# EasyEDA Pro project LED伏安特性实验仪.eprj, schematic 供电加恒流源

## Sheets
1 24V恒流源: Create Date: 2025-05-09; Page Name: 24V恒流源; Project Name: LED伏安特性实验仪; Schematic Name: 供电加恒流源; Update Date: 2026-06-09; Company: 嘉立创EDA; Page Size: A4; Version: V1.0
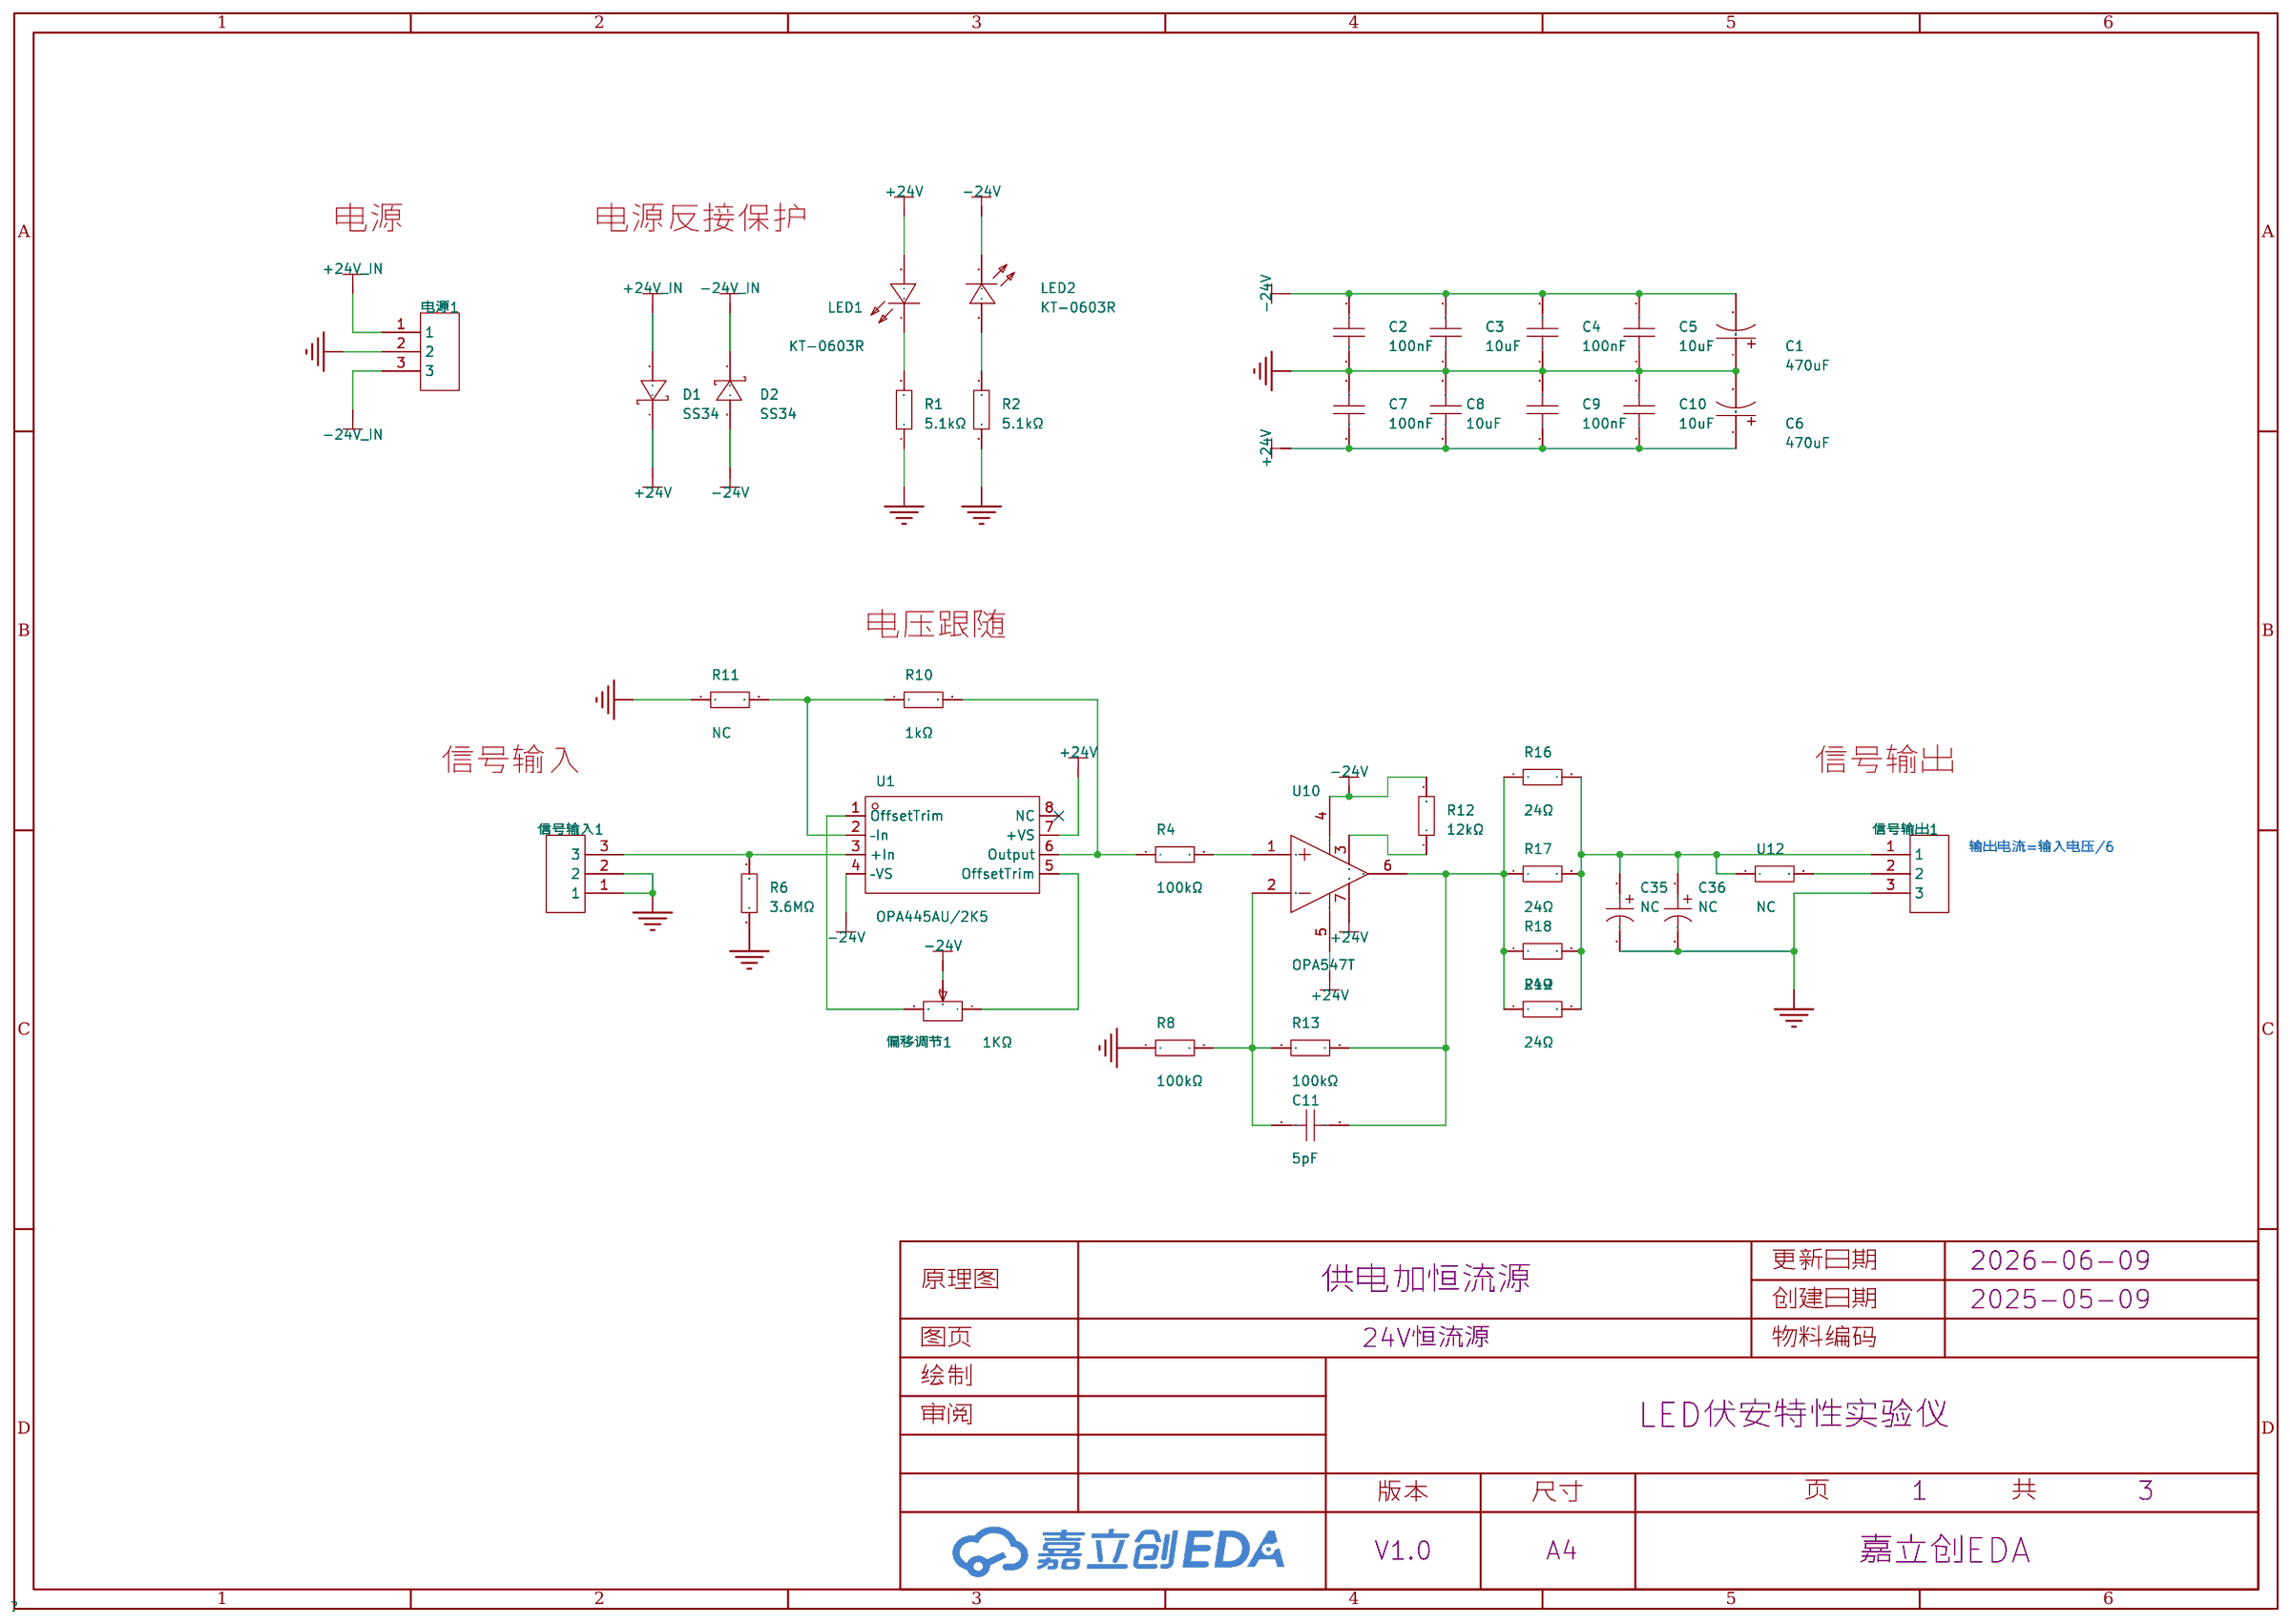
[diagram p4: 24V恒流源]
2 12V恒流源: Page Name: 12V恒流源; Project Name: 光磁共振实验仪; Update Date: 2025-05-09
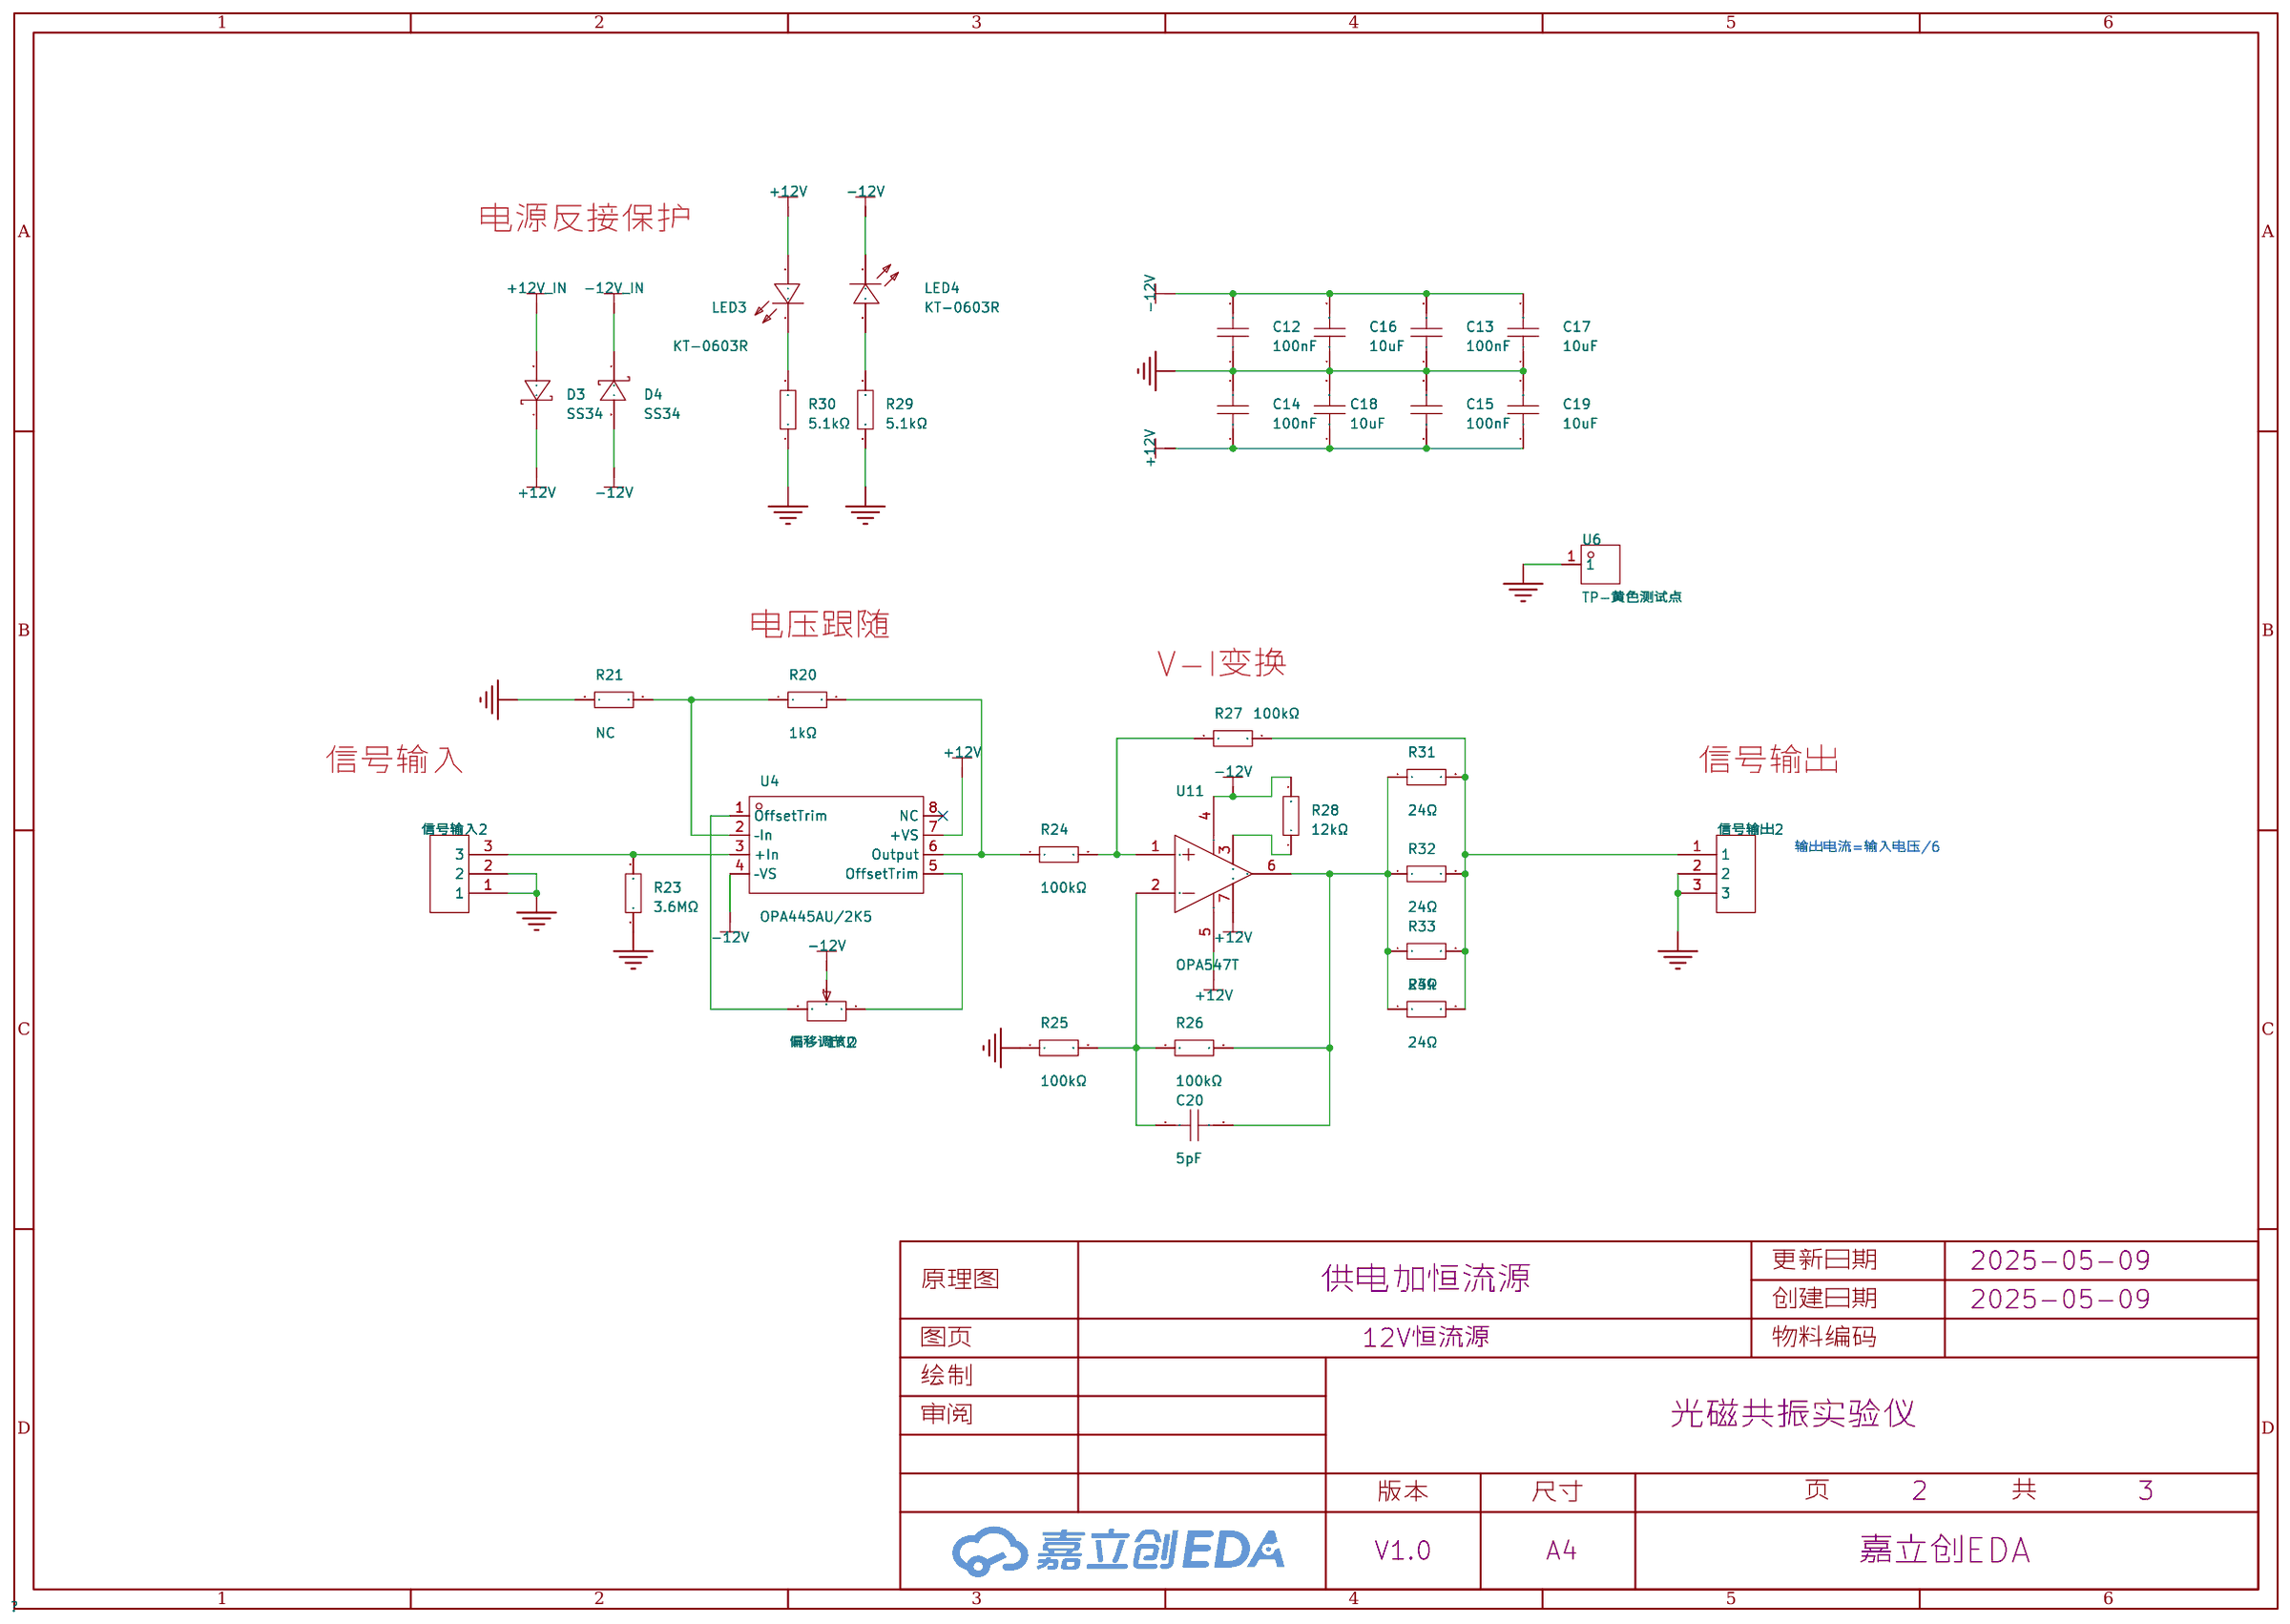
[diagram p5: 12V恒流源]
3 电源: Page Name: 电源; Project Name: 光磁共振实验仪; Update Date: 2025-05-09
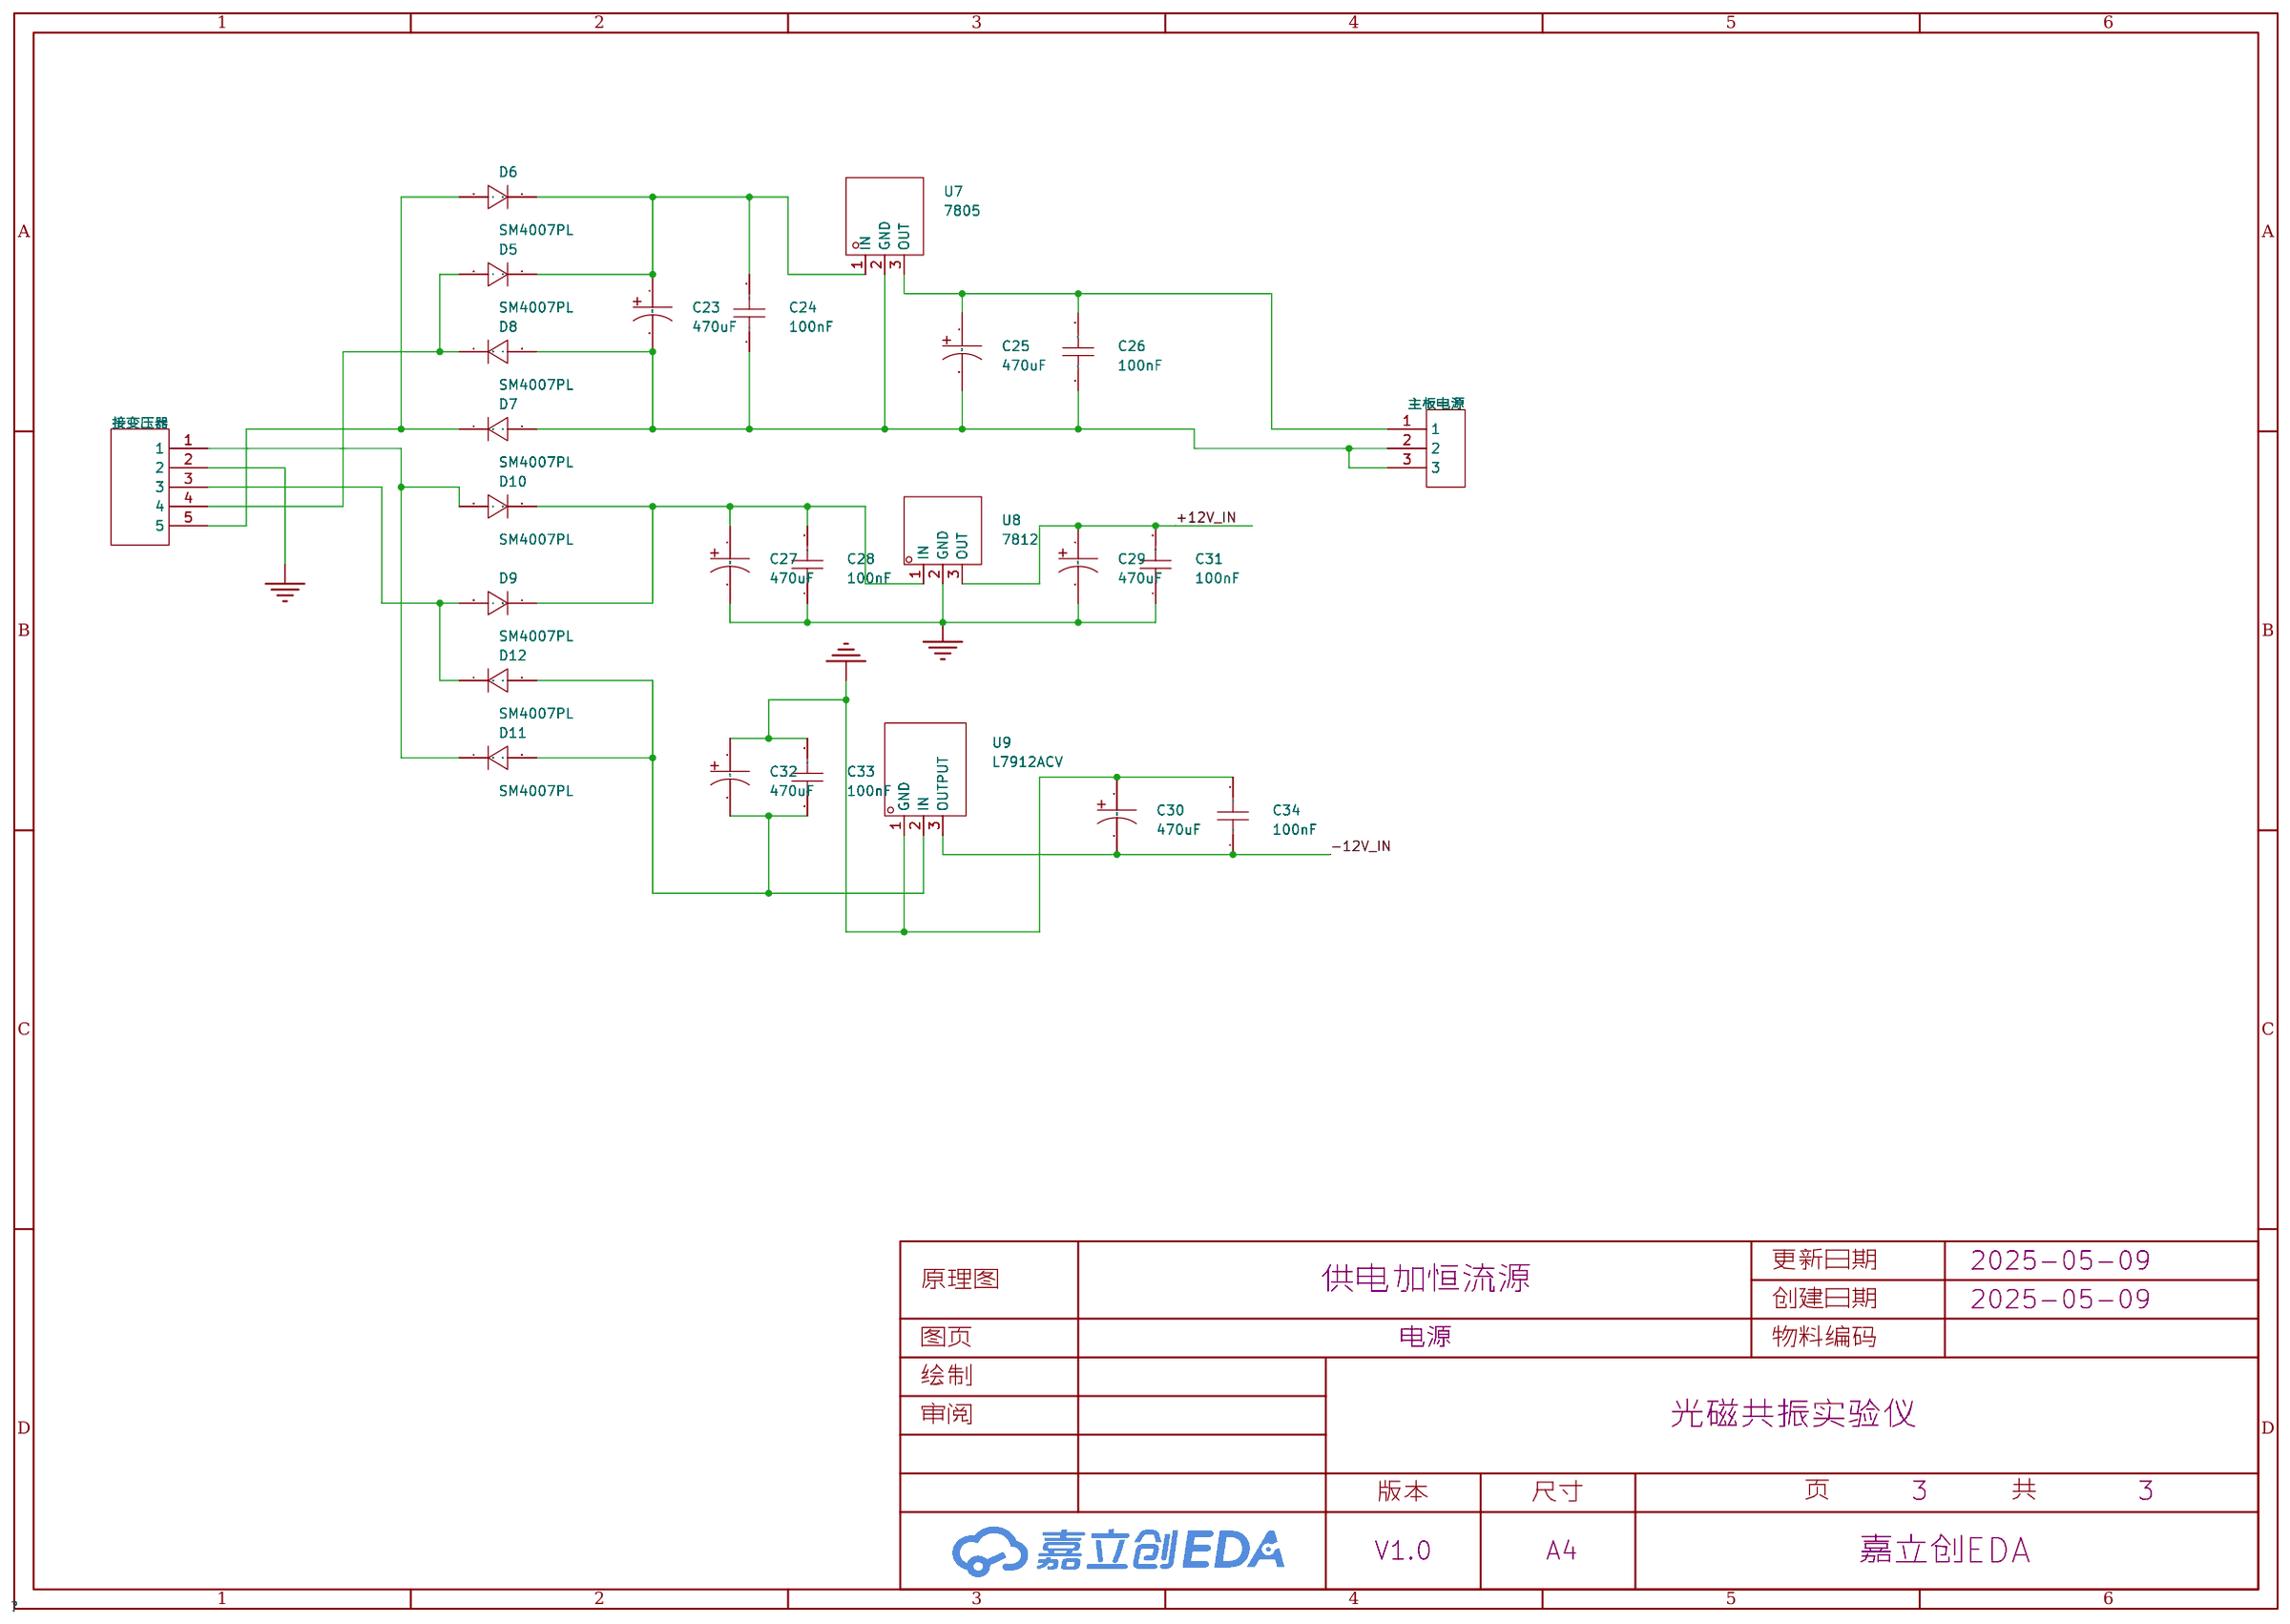
[diagram p6: 电源]

## Parts
sheet 12V恒流源
C12  100nF  [C0603]
C13  100nF  [C0603]
C14  100nF  [C0603]
C15  100nF  [C0603]
C16  10uF  [C0603]
C17  10uF  [C0603]
C18  10uF  [C0603]
C19  10uF  [C0603]
C20  5pF  [C0603]
D3  SS34  [SMA_L4.3-W2.6-LS5.2-RD]
D4  SS34  [SMA_L4.3-W2.6-LS5.2-RD]
LED3  KT-0603R  [LED0603-RD]
LED4  KT-0603R  [LED0603-RD]
R20  1kΩ  [R0603]
R21  NC  [R0603]
R23  3.6MΩ  [R0603]
R24  100kΩ  [R0603]
R25  100kΩ  [R0603]
R26  100kΩ  [R0603]
R27  100kΩ  [R0603]
R28  12kΩ  [R0603]
R29  5.1kΩ  [R0603]
R30  5.1kΩ  [R0603]
R31  24Ω  [R2512]
R32  24Ω  [R2512]
R33  24Ω  [R2512]
R34  24Ω  [R2512]
U4  OPA445AU/2K5  [SOIC-8_L4.9-W3.9-P1.27-LS6.0-BL]
U6  TP-黄色测试点  [TESTPOINT-TH_BD3.2]
U11  OPA547T  [TO-220-7-L10.5-W4.5-P1.27-BL]
信号输入2  -  [CH2.54-3插座]
信号输出2  -  [CH2.54-3插座]
偏移调节2  1KΩ  [RES-ADJ-TH_3296W]
sheet 24V恒流源
C1  470uF  [cap-th_bd8.0-p3.50-d0.6-fd_1]
C2  100nF  [C0603]
C3  10uF  [C0603]
C4  100nF  [C0603]
C5  10uF  [C0603]
C6  470uF  [cap-th_bd8.0-p3.50-d0.6-fd_1]
C7  100nF  [C0603]
C8  10uF  [C0603]
C9  100nF  [C0603]
C10  10uF  [C0603]
C11  5pF  [C0603]
C35  NC  [CAP-TH_BD8.0-P3.50-D0.6-FD_1]
C36  NC  [CAP-TH_BD8.0-P3.50-D0.6-FD_1]
D1  SS34  [SMA_L4.3-W2.6-LS5.2-RD]
D2  SS34  [SMA_L4.3-W2.6-LS5.2-RD]
LED1  KT-0603R  [LED0603-RD]
LED2  KT-0603R  [LED0603-RD]
R1  5.1kΩ  [R0603]
R2  5.1kΩ  [R0603]
R4  100kΩ  [R0603]
R6  3.6MΩ  [R0603]
R8  100kΩ  [R0603]
R10  1kΩ  [R0603]
R11  NC  [R0603]
R12  12kΩ  [R0603]
R13  100kΩ  [R0603]
R16  24Ω  [R2512]
R17  24Ω  [R2512]
R18  24Ω  [R2512]
R19  24Ω  [R2512]
U1  OPA445AU/2K5  [SOIC-8_L4.9-W3.9-P1.27-LS6.0-BL]
U10  OPA547T  [TO-220-7-L10.5-W4.5-P1.27-BL]
U12  NC  [绕线电阻2W]
信号输入1  -  [CH2.54-3插座]
信号输出1  -  [CH2.54-3插座]
偏移调节1  1KΩ  [RES-ADJ-TH_3296W]
电源1  -  [CH2.54-3插座]
sheet 电源
C23  470uF  [cap-th_bd8.0-p3.50-d0.6-fd_1]
C24  100nF  [C0603]
C25  470uF  [cap-th_bd8.0-p3.50-d0.6-fd_1]
C26  100nF  [C0603]
C27  470uF  [cap-th_bd8.0-p3.50-d0.6-fd_1]
C28  100nF  [C0603]
C29  470uF  [cap-th_bd8.0-p3.50-d0.6-fd_1]
C30  470uF  [cap-th_bd8.0-p3.50-d0.6-fd_1]
C31  100nF  [C0603]
C32  470uF  [cap-th_bd8.0-p3.50-d0.6-fd_1]
C33  100nF  [C0603]
C34  100nF  [C0603]
D5  SM4007PL  [SOD-123F_L2.8-W1.8-LS3.7-RD]
D6  SM4007PL  [SOD-123F_L2.8-W1.8-LS3.7-RD]
D7  SM4007PL  [SOD-123F_L2.8-W1.8-LS3.7-RD]
D8  SM4007PL  [SOD-123F_L2.8-W1.8-LS3.7-RD]
D9  SM4007PL  [SOD-123F_L2.8-W1.8-LS3.7-RD]
D10  SM4007PL  [SOD-123F_L2.8-W1.8-LS3.7-RD]
D11  SM4007PL  [SOD-123F_L2.8-W1.8-LS3.7-RD]
D12  SM4007PL  [SOD-123F_L2.8-W1.8-LS3.7-RD]
U7  7805  [TO-220-3_L10.2-W4.5-P2.54-L-1]
U8  7812  [TO-220-3_L10.0-W4.5-P2.54-L]
U9  L7912ACV  [TO-220-3_L10.0-W4.5-P2.54-T]
主板电源  -  [CH2.54-3插座]
接变压器  -  [CH2.54-5插座]

## Library data of the parts
C2 C4 C7 C9 C12-C15 C24 C26 C28 C31 C33 C34 = CC0603KRX7R9BB104: 容值:100nF;精度:±10%;额定电压:50V;材质(温度系数):X7R;; LCSC Part Name: 100nF ±10% 50V; Supplier Part: C14663; Manufacturer: YAGEO(国巨); Supplier Footprint: 0603; JLCPCB Part Class: 基础库; Datasheet: https://atta.szlcsc.com/upload/public/pdf/source/20180910/C282072_33301C7F631E79921B82A8DAC6BCC5B3.pdf; Supplier: LCSC; Tolerance: ±10%; Voltage Rated: 50V; Temperature Coefficient: X7R
C3 C5 C8 C10 C16-C19 = CL10A106MA8NRNC: 容值:10uF;精度:±20%;额定电压:25V;材质(温度系数):X5R;; LCSC Part Name: 10uF ±20% 25V; Supplier Part: C96446; Manufacturer: SAMSUNG(三星); Supplier Footprint: 0603; JLCPCB Part Class: 基础库; Datasheet: https://atta.szlcsc.com/upload/public/pdf/source/20160218/1457707763339.pdf; Supplier: LCSC; Tolerance: ±20%; Voltage Rated: 25V; Temperature Coefficient: X5R
C11 C20 = CGA3E2C0G2A050C080AA: 容值:5pF;额定电压:100V;材质(温度系数):C0G;; LCSC Part Name: 5pF 100V ±0.25pF; Supplier Part: C3879212; Manufacturer: TDK; Supplier Footprint: 0603; JLCPCB Part Class: 扩展库; Datasheet: https://atta.szlcsc.com/upload/public/pdf/source/20230606/D94174B26D5D12F87246C65F1689D091.pdf; Supplier: LCSC; Voltage Rated: 100V; Temperature Coefficient: C0G
D1-D4 = SS34_C8678: 二极管配置:独立式;正向压降(Vf):550mV@3A;直流反向耐压(Vr):40V;整流电流:3A;; LCSC Part Name: 电压:40V 电流:3A; Supplier Part: C8678; Manufacturer: MDD(辰达半导体); Supplier Footprint: SMA(DO-214AC); JLCPCB Part Class: 基础库; Datasheet: https://atta.szlcsc.com/upload/public/pdf/source/20240710/2118BB86FDDB2E0B294389AC1F3F65C8.pdf; Supplier: LCSC; Diode Configuration: 独立式; Forward Voltage (Vf@If): 550mV@3A; Reverse Voltage (Vr): 40V; Rectified Current: 3A; Reverse Leakage Current (Ir): 500uA@40V
LED1-LED4 = KT-0603R: 发光颜色:红色;功率:-;正向电流:-;主波长:-;二极管配置:-;透镜颜色:-;色温:-;发光角度:-;载带方式:-;工作温度:-40℃~+85℃;; LCSC Part Name: 0603 红灯 高亮; Supplier Part: C2286; Manufacturer: KENTO; Supplier Footprint: 0603; JLCPCB Part Class: 基础库; Datasheet: https://atta.szlcsc.com/upload/public/pdf/source/20160616/1466072038404.pdf; Supplier: LCSC; Emitted Color: 红色; Operating Temperature: -40℃~+85℃
R10 R11 R20 R21 = 0603WAF1001T5E: 电阻类型:厚膜电阻;阻值:1kΩ;精度:±1%;功率:100mW;最大工作电压:75V;温度系数:±100ppm/℃;; LCSC Part Name: 1kΩ ±1% 100mW 厚膜电阻; Supplier Part: C21190; Manufacturer: UNI-ROYAL(厚声); Supplier Footprint: 0603; JLCPCB Part Class: 基础库; Datasheet: https://atta.szlcsc.com/upload/public/pdf/source/20200306/C422600_1E6D84923E4A46A82E41ADD87F860B5C.pdf; Supplier: LCSC; Type: 厚膜电阻; Tolerance: ±1%; Power(Watts): 100mW; Overload Voltage (Max): 75V; Temperature Coefficient: ±100ppm/℃; Operating Temperature Range: -55℃~+155℃
R6 R23 = RTT03365JTP: 电阻类型:厚膜电阻;阻值:3.6MΩ;精度:±5%;功率:100mW;最大工作电压:75V;温度系数:±100ppm/℃;; LCSC Part Name: 厚膜电阻 3.6MΩ ±5% 100mW; Supplier Part: C103584; Manufacturer: RALEC(旺诠); Supplier Footprint: 0603; JLCPCB Part Class: 扩展库; Datasheet: https://atta.szlcsc.com/upload/public/pdf/source/20191219/C158410_884373A5B7E1BC76BF57BC45A946C093.pdf; Supplier: LCSC; Type: 厚膜电阻; Tolerance: ±5%; Power(Watts): 100mW; Overload Voltage (Max): 75V; Temperature Coefficient: ±100ppm/℃; Operating Temperature Range: -55℃~+155℃
R4 R8 R13 R24-R27 = 0603WAF1003T5E: 电阻类型:厚膜电阻;阻值:100kΩ;精度:±1%;功率:100mW;最大工作电压:75V;温度系数:±100ppm/℃;; LCSC Part Name: 100kΩ ±1% 100mW 厚膜电阻; Supplier Part: C25803; Manufacturer: UNI-ROYAL(厚声); Supplier Footprint: 0603; JLCPCB Part Class: 基础库; Datasheet: https://atta.szlcsc.com/upload/public/pdf/source/20200306/C422600_1E6D84923E4A46A82E41ADD87F860B5C.pdf; Supplier: LCSC; Type: 厚膜电阻; Tolerance: ±1%; Power(Watts): 100mW; Overload Voltage (Max): 75V; Temperature Coefficient: ±100ppm/℃; Operating Temperature Range: -55℃~+155℃
R12 R28 = 0603WAF1202T5E: 电阻类型:厚膜电阻;阻值:12kΩ;精度:±1%;功率:100mW;最大工作电压:75V;温度系数:±100ppm/℃;; LCSC Part Name: 12kΩ ±1% 100mW 厚膜电阻; Supplier Part: C22790; Manufacturer: UNI-ROYAL(厚声); Supplier Footprint: 0603; JLCPCB Part Class: 基础库; Datasheet: https://atta.szlcsc.com/upload/public/pdf/source/20200306/C422600_1E6D84923E4A46A82E41ADD87F860B5C.pdf; Supplier: LCSC; Type: 厚膜电阻; Tolerance: ±1%; Power(Watts): 100mW; Overload Voltage (Max): 75V; Temperature Coefficient: ±100ppm/℃; Operating Temperature Range: -55℃~+155℃
R1 R2 R29 R30 = 0603WAF5101T5E: 电阻类型:厚膜电阻;阻值:5.1kΩ;精度:±1%;功率:100mW;最大工作电压:75V;温度系数:±100ppm/℃;; LCSC Part Name: 5.1kΩ ±1% 100mW 厚膜电阻; Supplier Part: C23186; Manufacturer: UNI-ROYAL(厚声); Supplier Footprint: 0603; JLCPCB Part Class: 基础库; Datasheet: https://atta.szlcsc.com/upload/public/pdf/source/20200306/C422600_1E6D84923E4A46A82E41ADD87F860B5C.pdf; Supplier: LCSC; Type: 厚膜电阻; Tolerance: ±1%; Power(Watts): 100mW; Overload Voltage (Max): 75V; Temperature Coefficient: ±100ppm/℃; Operating Temperature Range: -55℃~+155℃
R16-R19 R31-R34 = CRH2512F24R0E04Z: 电阻类型:厚膜电阻;阻值:24Ω;精度:±1%;功率:2W;最大工作电压:200V;温度系数:±100ppm/℃;; LCSC Part Name: 厚膜电阻 24Ω ±1% 2W; Supplier Part: C175254; Manufacturer: EVER OHMS(天二科技); Supplier Footprint: 2512; JLCPCB Part Class: 扩展库; Datasheet: https://atta.szlcsc.com/upload/public/pdf/source/20190415/C175809_DD1C9F6158BC05995187FFAA24C3E24C.pdf; Supplier: LCSC; Type: 厚膜电阻; Tolerance: ±1%; Power(Watts): 2W; Overload Voltage (Max): 200V; Temperature Coefficient: ±100ppm/℃; Operating Temperature Range: -55℃~+155℃
U1 U4 = OPA445AU/2K5: OPA445 高电压 FET 输入运算放大器; Supplier Part: C1348606; Manufacturer: TI(德州仪器); Supplier Footprint: SOIC-8; JLCPCB Part Class: 扩展库; Datasheet: https://www.ti.com/cn/lit/gpn/opa445; Supplier: LCSC
U6 = TP-黄色测试点: Supplier Part: C9900007422; Supplier Footprint: TESTPOINT-TH_BD-2P-P2.00; JLCPCB Part Class: 扩展库; Supplier: LCSC
U10 U11 = OPA547T: 放大器数:单路;增益带宽积(GBP):1MHz;压摆率(SR):6V/us;输入偏置电流(Ib):100nA;; Supplier Part: C138711; Manufacturer: TI(德州仪器); Supplier Footprint: TO-220-7; JLCPCB Part Class: 扩展库; Datasheet: https://www.ti.com/cn/lit/gpn/opa547; Supplier: LCSC; Number of Channels: 单路; Gain Bandwidth Product: 1MHz; Slew Rate: 6V/us; Ib - Input Bias Current: 100nA; Quiescent Current: 10mA; Output Current: 750mA; Operating Temperature: -40℃~+85℃
主板电源 信号输入1 信号输入2 信号输出1 信号输出2 电源1 = HDR-3P
偏移调节1 偏移调节2 = 环保 3296W-1-202LF: 阻值:-;功率:-;; LCSC Part Name: 2KΩ ±10% ±250ppm/℃; Supplier Part: C5028; Supplier Footprint: 3296W; JLCPCB Part Class: 扩展库; Supplier: LCSC
C1 C6 C23 C25 C27 C29 C30 C32 = RVT1A471M0607_C335982: 容值:470uF;精度:±20%;额定电压:10V;纹波电流:200mA@120Hz;等效串联电阻:-;; LCSC Part Name: 470uF ±20% 10V; Supplier Part: C335982; Manufacturer: ROQANG(容强); Manufacturer Part: RVT1A471M0607; Supplier Footprint: SMD,D6.3xL7.7mm; Datasheet: https://atta.szlcsc.com/upload/public/pdf/source/20181128/C335987_23CA7AA50FB42690DF736C43FE112376.pdf; Supplier: LCSC; Tolerance: ±20%; Rated Voltage: 10V; Ripple Current: 200mA@120Hz; φD: 6.3mm; L: 7.7mm; Lifetime @ Temp: 2000hrs@105℃; Operating Temperature: -40℃~+105℃
C35 C36 = 100uF: Supplier Part: C9900016884; Supplier Footprint: CAP-TH_BD8.0-P3.50-D1.0-FD; JLCPCB Part Class: 扩展库; Supplier: LCSC
U12 = 功率电阻5W
D5-D12 = SM4007PL_C64898: 二极管配置:独立式;正向压降(Vf):1.1V@1A;直流反向耐压(Vr):1kV;整流电流:1A;; LCSC Part Name: 电压:1kV 电流:1A; Supplier Part: C64898; Manufacturer: MDD(辰达半导体); Supplier Footprint: SOD-123FL; JLCPCB Part Class: 基础库; Datasheet: https://atta.szlcsc.com/upload/public/pdf/source/20230823/16A8FDE162764C9B685A3717F2DA3690.pdf; Supplier: LCSC; Diode Configuration: 独立式; Forward Voltage (Vf@If): 1.1V@1A; Reverse Voltage (Vr): 1kV; Rectified Current: 1A; Reverse Leakage Current: 10uA@1kV
U7 = 7805: 输出类型:固定;最大输入电压:35V;输出电压:5V;最大输出电流:1.5A;电源纹波抑制比(PSRR):62dB@(120Hz);输出极性:正极;; LCSC Part Name: 输入35V 输出5V 1.5A; Supplier Part: C4944936; Manufacturer: SY(顺烨); Supplier Footprint: TO-220AB; JLCPCB Part Class: 扩展库; Datasheet: https://atta.szlcsc.com/upload/public/pdf/source/20220719/323A3F14557C229271C454C7C0F759A5.pdf; Supplier: LCSC; Output Type: 固定; Maximum Input Voltage: 35V; Output Voltage: 5V; MAX Output Current: 1.5A; Power Supply Rejection Ratio (PSRR): 62dB@(120Hz); Output Polarity: 正极
U8 = 7812: 输出类型:固定;最大输入电压:35V;输出电压:12V;最大输出电流:1.5A;电源纹波抑制比(PSRR):55dB@(120Hz);输出极性:正极;; LCSC Part Name: 输入35V 输出12V 1.5A; Supplier Part: C358369; Manufacturer: BLUE ROCKET(蓝箭); Supplier Footprint: TO-220; JLCPCB Part Class: 扩展库; Datasheet: https://atta.szlcsc.com/upload/public/pdf/source/20190129/C358369_76FC1BF920F4FC034B3298D16553EF92.pdf; Supplier: LCSC; Output Type: 固定; Maximum Input Voltage: 35V; Output Voltage: 12V; MAX Output Current: 1.5A; Power Supply Rejection Ratio (PSRR): 55dB@(120Hz); Dropout Voltage: 2V@(1A); Output Polarity: 正极; Number of Outputs: 1
U9 = L7912ACV: 输出类型:固定;最大输入电压:35V;输出电压:12V;输出电流:1.5A;电源纹波抑制比(PSRR):60dB@(120Hz);输出极性:负极;; LCSC Part Name: 负稳压器; Supplier Part: C163542; Manufacturer: ST(意法半导体); Supplier Footprint: TO-220; JLCPCB Part Class: 扩展库; Datasheet: https://atta.szlcsc.com/upload/public/pdf/source/20180105/C163543_15151574477301234741.pdf; Supplier: LCSC; Output Type: 固定; Maximum Input Voltage: 35V; Output Voltage: 12V; Output Current: 1.5A; Power Supply Rejection Ratio (PSRR): 60dB@(120Hz); Dropout Voltage: 1.1V@(1A); standby current: 3mA; Feature: 短路保护；热保护(TSD); Operating Temperature: 0℃~+125℃; Output Polarity: 负极; Number of Outputs: 1
接变压器 = HDR-5P

## Nets
+12V: C14.1 C15.1 C18.1 C19.1 D3.1(K) LED3.2(A) U4.7(+VS) U11.5(V+) U11.7(E/S)
+12V_IN: C29.1 C31.2 D3.2(A) U8.3(OUT)
+24V: C6.1 C7.1 C8.1 C9.1 C10.1 D1.1(K) LED1.2(A) U1.7(+VS) U10.5(V+) U10.7(E/S)
+24V_IN: D1.2(A) 电源1.1
-12V: C12.2 C13.2 C16.2 C17.2 D4.2(A) LED4.1(K) R28.2 U4.4(–VS) U11.4(V-) 偏移调节2.2
-12V_IN: C30.2 C34.1 D4.1(K) U9.3(OUTPUT)
-24V: C1.2 C2.2 C3.2 C4.2 C5.2 D2.2(A) LED2.1(K) R12.2 U1.4(–VS) U10.4(V-) 偏移调节1.2
-24V_IN: D2.1(K) 电源1.3
GND: C1.1 C2.1 C3.1 C4.1 C5.1 C6.2 C7.2 C8.2 C9.2 C10.2 C12.1 C13.1 C14.2 C15.2 C16.1 C17.1 C18.2 C19.2 C27.2 C28.1 C29.2 C30.1 C31.1 C32.1 C33.2 C34.2 C35.2 C36.2 R1.1 R2.1 R6.1 R8.1 R11.1 R21.1 R23.1 R25.1 R29.1 R30.1 U6.1 U8.2(GND) U9.1(GND) 信号输入1.1 信号输入1.2 信号输入2.1 信号输入2.2 信号输出1.3 信号输出2.2 信号输出2.3 接变压器.2 电源1.2
$1N1627: R10.1 R11.2 U1.2(–In)
$1N1629: U1.1(OffsetTrim) 偏移调节1.3
$1N1630: U1.5(OffsetTrim) 偏移调节1.1
$1N1634: R4.1 R10.2 U1.6(Output)
$1N1636: C11.1 R8.2 R13.1 U10.2(IN-)
$1N1637: C11.2 R13.2 R16.1 R17.1 R18.1 R19.1 U10.6(OUT)
$1N1642: R12.1 U10.3(ILIM)
$1N1654: R6.2 U1.3(+In) 信号输入1.3
$1N1655: LED1.1(K) R1.2
$1N1656: LED2.2(A) R2.2
$1N4036: U12.2 信号输出1.2
$2N1627: R20.1 R21.2 U4.2(–In)
$2N1629: U4.1(OffsetTrim) 偏移调节2.3
$2N1630: U4.5(OffsetTrim) 偏移调节2.1
$2N1634: R20.2 R24.1 U4.6(Output)
$2N1636: C20.1 R25.2 R26.1 U11.2(IN-)
$2N1637: C20.2 R26.2 R31.1 R32.1 R33.1 R34.1 U11.6(OUT)
$2N1639: R24.2 R27.1 U11.1(IN+)
$2N1642: R28.1 U11.3(ILIM)
$2N1645: R27.2 R31.2 R32.2 R33.2 R34.2 信号输出2.1
$2N1654: R23.2 U4.3(+In) 信号输入2.3
$2N1655: LED3.1(K) R30.2
$2N1656: LED4.2(A) R29.2
$3N669: C23.1 C24.2 D5.1(C) D6.1(C) U7.1(IN)
$3N1351: C27.1 C28.2 D9.1(C) D10.1(C) U8.1(IN)
$3N1949: C32.2 C33.1 D11.2(A) D12.2(A) U9.2(IN)
$3N2089: C25.1 C26.2 U7.3(OUT) 主板电源.1
$3N2139: C23.2 C24.1 C25.2 C26.1 D7.2(A) D8.2(A) U7.2(GND) 主板电源.2 主板电源.3
$3N2809: D6.2(A) D7.1(C) 接变压器.5
$3N2828: D5.2(A) D8.1(C) 接变压器.4
$3N2854: D10.2(A) D11.1(C) 接变压器.1
$3N2892: D9.2(A) D12.1(C) 接变压器.3
Net-(C35-1): C35.1 C36.1 R16.2 R17.2 R18.2 R19.2 U12.1 信号输出1.1
Net-(R4-2): R4.2 U10.1(IN+)

Not connected (* = marked no-connect by the designer): U1 8(NC)*; U4 8(NC)*

## Notes on the sheets
sheet 1
- 电源
- 电源反接保护
- 电压跟随
- 信号输入
- 信号输出
- 输出电流=输入电压/6
sheet 2
- 电源反接保护
- 电压跟随
- V-I变换
- 信号输入
- 信号输出
- 输出电流=输入电压/6
